# EAGLE design dcdcboard-v1 (EAGLE 7.1.0)
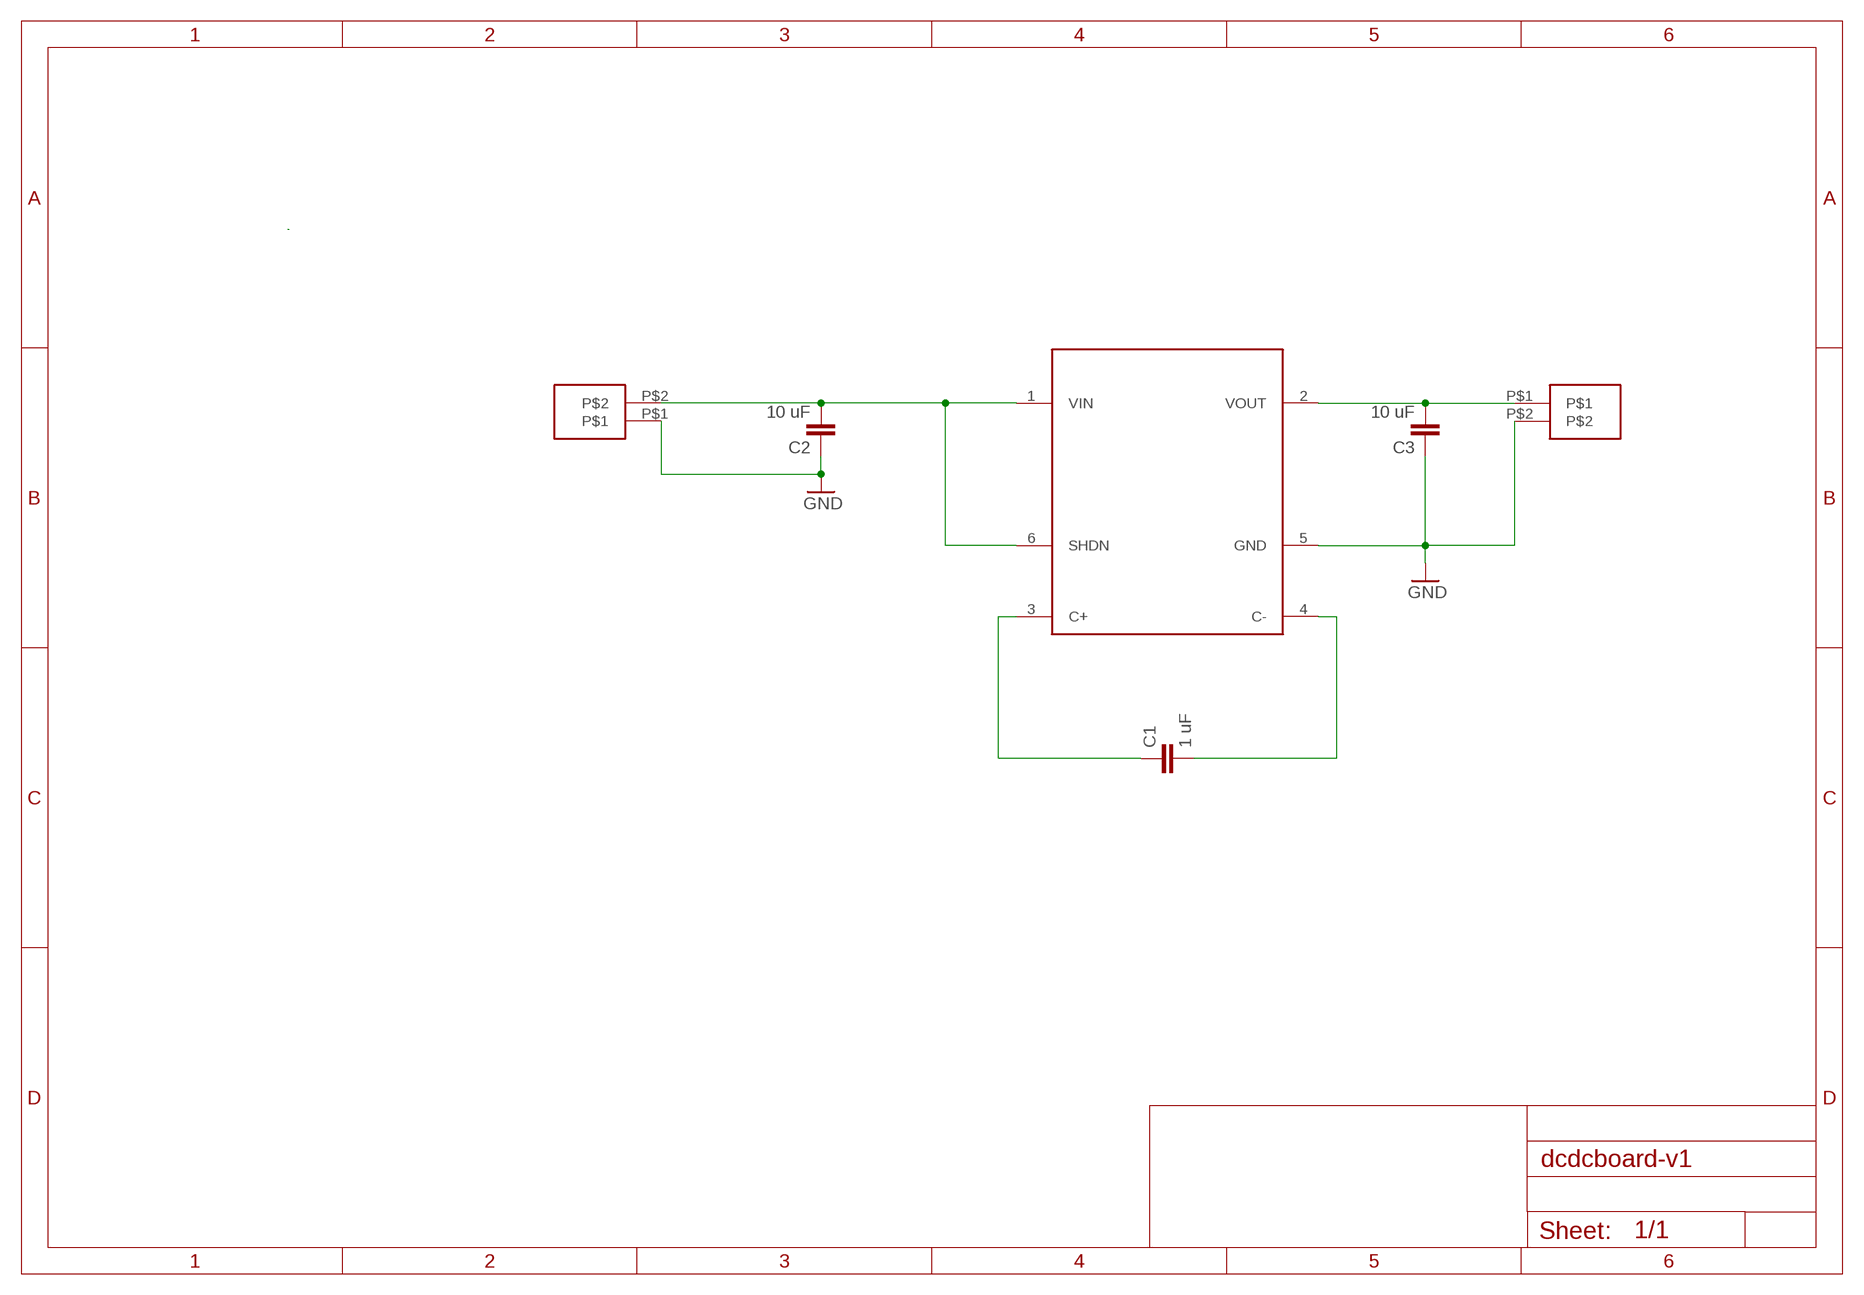
[diagram p0: schematic, sheet 1]

## Parts
C1  1 uF  CAP0805  [0805]
C2  10 uF  CAP0805  [0805]
C3  10 uF  CAP0805  [0805]
U$1  LTC1983  [SSOT23-6]
U$2  SPRING-TERMINAL  [SPRING-TERMINAL]
U$3  SPRING-TERMINAL  [SPRING-TERMINAL]

## Nets
GND: C2.1 C3.1 U$1.5(GND) U$2.P$1 U$3.P$2
N$11: C1.2 U$1.4(C-)
N$13: C1.1 U$1.3(C+)
VIN: C2.2 U$1.1(VIN) U$1.6(SHDN) U$2.P$2
VOUT: C3.2 U$1.2(VOUT) U$3.P$1

## Library data of the parts
C1-C3 = SparkFun-Capacitors:CAP: Capacitor Standard 0603 ceramic capacitor, and 0.1" leaded capacitor.
U$1 = spietz-library:LTC1983
U$2 U$3 = spietz-library:SPRING-TERMINAL

## Net classes
1 vcc: width 0.254 mm

## Board
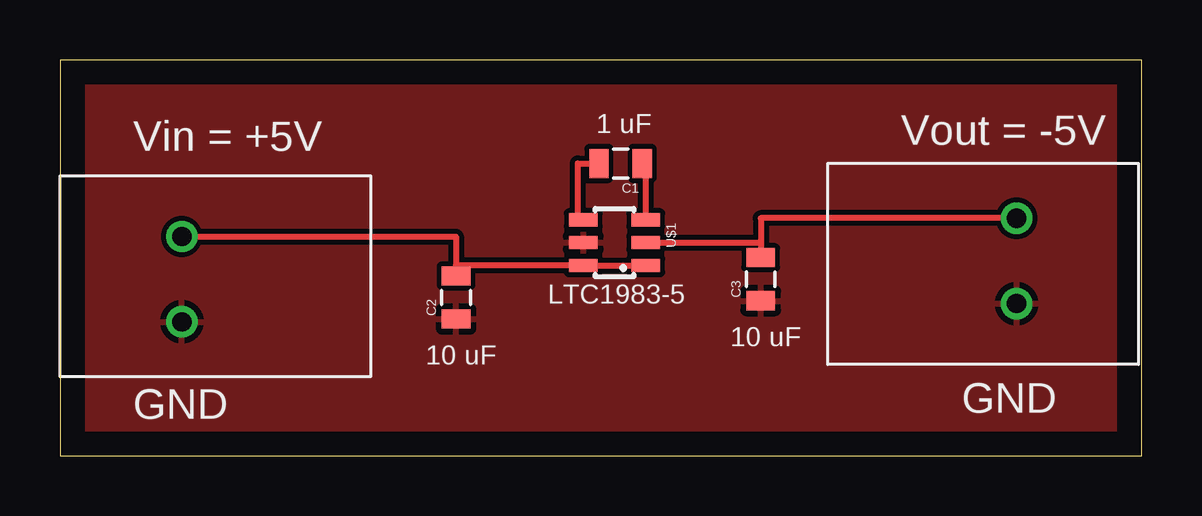
[diagram p1: board, top side]
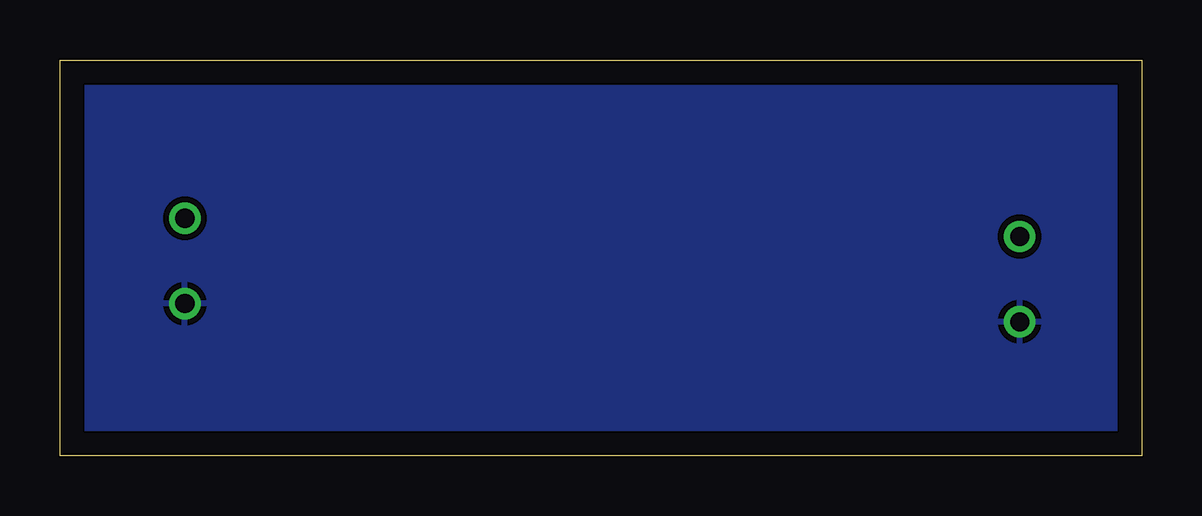
[diagram p2: board, bottom side, seen from below]

Size 45.09 x 16.51 mm. Coordinates in mm from the lower left corner, seen from the top.
Outline: 0,0 45.09,0 45.09,16.51 0,16.51 0,0
Copper layers (1*16): Top 0.035mm / dielectric 1.5mm / Bottom 0.035mm
Design rules "default": minimum track width 10mil, minimum drill 24mil, track to track 8mil, track to pad 8mil, pad to pad 8mil, via to via 8mil, smd to smd 8mil, copper to edge 40mil, drill to drill 8mil, minimum pad ring 10mil, minimum via ring 8mil, stop-mask expansion 4mil, vias tented up to drill 0mil, thermal gap 10mil

### Footprints (pad centres in the part's own frame; a part is rotated, then mirrored left to right if it is on the bottom)
0805 = smd 0.8 x 1.2: 1 -0.9,0; 2 0.9,0
SSOT23-6 = smd 0.55 x 1.2: 1 0.95,1.3; 2 0,1.3; 3 -0.95,1.3; 4 -0.95,-1.3; 5 0,-1.3; 6 0.95,-1.3
SPRING-TERMINAL = drill 0.8: P$1 5.08,1.778; P$2 5.08,5.334

### Placement (x,y rotation side)
C1  23.37,12.19 180 top
C2  16.51,6.6 90 top
C3  29.21,7.37 90 top
U$1  23.11,8.89 270 top
U$2  0,3.81 0 top
U$3  44.96,11.68 180 top

### Tracks (layer width: path | path; a pad name or v marks a point on that pad's centre or on a via)
GND
  pour Top (isolate 0.152): -1.27,61.72 -1.27,-1.27 89.92,-1.27 89.92,61.98
  pour Bottom (isolate 0.254): -2.54,62.36 -2.54,-2.54 93.22,-2.54 93.22,62.36
N$11
  Top 0.254: U$1.4 21.59,9.84 21.59,12.19 C1.2
N$13
  Top 0.254: C1.1 24.41,12.19 U$1.3
VIN
  Top 0.254: U$2.P$2 16.51,9.14 C2.2 16.51,7.94 U$1.6 U$1.1
VOUT
  Top 0.254: U$1.2 29.21,8.89 | 29.21,8.89 C3.2 | U$3.P$1 29.21,9.91 29.21,8.89

### Text on the board
tPlace: Vin = +5V | 1 uF | Vout = -5V | LTC1983-5 | 10 uF | 10 uF | GND | GND